# Altium schematic sheet DRIVERS.SchDoc
size 420 x 297 mm; PageSetup: Record=PageOptions|CenterHorizontal=False|CenterVertical=False|PrintScale=0.95|XCorrection=0.00|YCorrection=0.00|PrintKind=1|BorderSize=5000000|LeftOffset=0|BottomOffset=0|Orientation=1|PaperLength=1000|PaperWidth=1000|Scale=100|PaperSource=15|PrintQuality=600|MediaType=1|DitherType=10|PaperKind=A4|PrintScaleMode=1
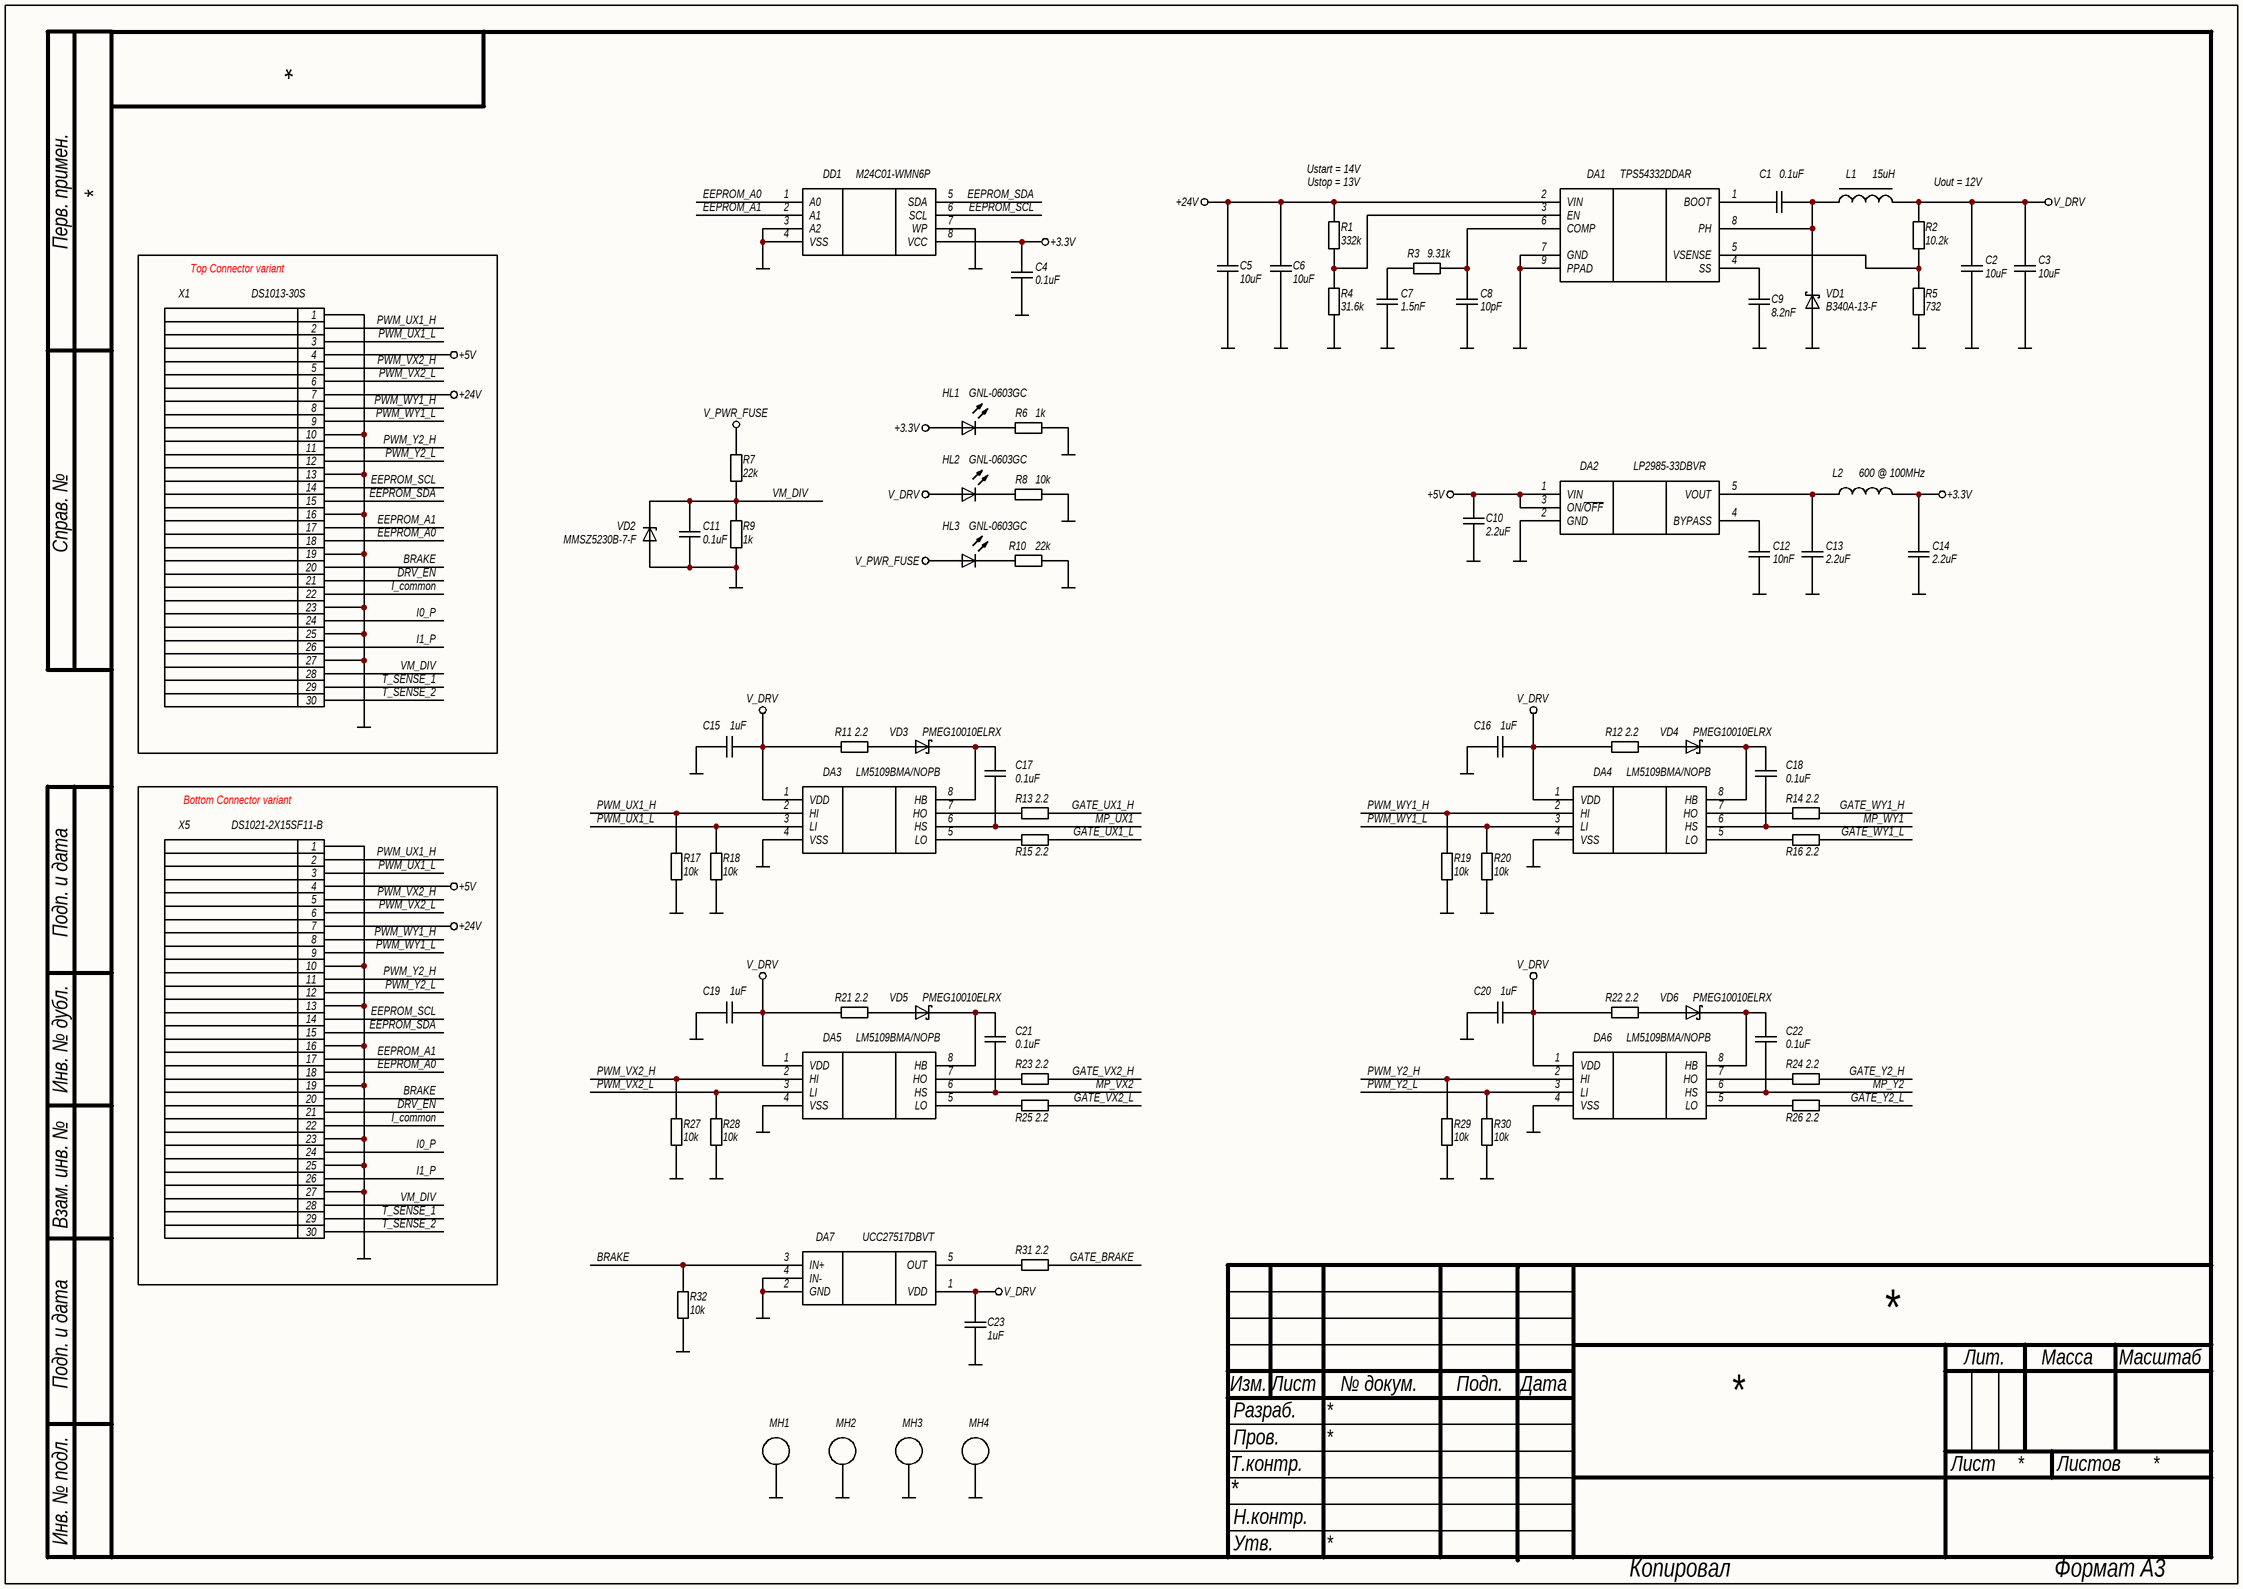
[diagram p0: DRIVERS.SchDoc]

## Parts
C1  0.1uF  [C0603N]
C2  10uF  [C0805N]
C3  10uF  [C0805N]
C4  0.1uF  [C0603N]
C5  10uF  [C1206N]
C6  10uF  [C1206N]
C7  1.5nF  [C0603N]
C8  10pF  [C0603N]
C9  8.2nF  [C0603N]
C10  2.2uF  [C0603N]
C11  0.1uF  [C0603N]
C12  10nF  [C0603N]
C13  2.2uF  [C0603N]
C14  2.2uF  [C0603N]
C15  1uF  [C0805N]
C16  1uF  [C0805N]
C17  0.1uF  [C0603N]
C18  0.1uF  [C0603N]
C19  1uF  [C0805N]
C20  1uF  [C0805N]
C21  0.1uF  [C0603N]
C22  0.1uF  [C0603N]
C23  1uF  [C0805N]
DA1  TPS54332DDAR  [SOIC8-EP]
DA2  LP2985-33DBVR  [DBV0005A (SOT23-5)]
DA3  LM5109BMA/NOPB  [D0008A]
DA4  LM5109BMA/NOPB  [D0008A]
DA5  LM5109BMA/NOPB  [D0008A]
DA6  LM5109BMA/NOPB  [D0008A]
DA7  UCC27517DBVT  [DBV0005A (SOT23-5)]
DD1  M24C01-WMN6P  [SOIC8]
HL1  GNL-0603GC  [LED0603]
HL2  GNL-0603GC  [LED0603]
HL3  GNL-0603GC  [LED0603]
L1  15uH  [SRN8040]
L2  600 @ 100MHz  [FB0603N]
MH1  MNT_HOLE_PL  [MH_3.2_5.4_PLATED_VIA]  (value not drawn)  (no BOM)
MH2  MNT_HOLE_PL  [MH_3.2_5.4_PLATED_VIA]  (value not drawn)  (no BOM)
MH3  MNT_HOLE_PL  [MH_3.2_5.4_PLATED_VIA]  (value not drawn)  (no BOM)
MH4  MNT_HOLE_PL  [MH_3.2_5.4_PLATED_VIA]  (value not drawn)  (no BOM)
R1  332k  [R0603N]
R2  10.2k  [R0603N]
R3  9.31k  [R0603N]
R4  31.6k  [R0603N]
R5  732  [R0603N]
R6  1k  [R0603N]
R7  22k  [R0603N]
R8  10k  [R0603N]
R9  1k  [R0603N]
R10  22k  [R0603N]
R11  2.2  [R0603N]
R12  2.2  [R0603N]
R13  2.2  [R0603N]
R14  2.2  [R0603N]
R15  2.2  [R0603N]
R16  2.2  [R0603N]
R17  10k  [R0603N]
R18  10k  [R0603N]
R19  10k  [R0603N]
R20  10k  [R0603N]
R21  2.2  [R0603N]
R22  2.2  [R0603N]
R23  2.2  [R0603N]
R24  2.2  [R0603N]
R25  2.2  [R0603N]
R26  2.2  [R0603N]
R27  10k  [R0603N]
R28  10k  [R0603N]
R29  10k  [R0603N]
R30  10k  [R0603N]
R31  2.2  [R0603N]
R32  10k  [R0603N]
VD1  B340A-13-F  [SMA]
VD2  MMSZ5230B-7-F  [SOD123]
VD3  PMEG10010ELRX  [SOD123W]
VD4  PMEG10010ELRX  [SOD123W]
VD5  PMEG10010ELRX  [SOD123W]
VD6  PMEG10010ELRX  [SOD123W]
X1  DS1013-30S  [2.54_2X15_HEADER_BOX]
X5  DS1021-2X15SF11-B  [2.54_2X15_HEADER]

## Blocks framed on the sheet
Top Connector variant: X1
Bottom Connector variant: X5

## Nets
+3.3V: C4.2 C14.2 DD1.8(VCC) HL1.2(A) L2.2
+5V: C10.2 DA2.1(VIN) DA2.3(ON/~{OFF}) X1.4 X5.4
+24V: C5.2 C6.2 DA1.2(VIN) R1.1 X1.7 X5.7
GND: C2.2 C3.1 C4.1 C5.1 C6.1 C7.1 C8.1 C9.1 C10.1 C11.1 C12.1 C13.1 C14.1 C15.2 C16.2 C19.2 C20.2 C23.2 DA1.7(GND) DA1.9(PPAD) DA2.2(GND) DA3.4(VSS) DA4.4(VSS) DA5.4(VSS) DA6.4(VSS) DA7.2(GND) DA7.4(IN-) DD1.3(A2) DD1.4(VSS) DD1.7(WP) MH1.1 MH2.1 MH3.1 MH4.1 R4.2 R5.2 R6.2 R8.2 R9.2 R10.2 R17.2 R18.2 R19.2 R20.2 R27.2 R28.2 R29.2 R30.2 R32.2 VD1.2(A) VD2.2(A) X1.1 X1.10 X1.13 X1.16 X1.19 X1.23 X1.25 X1.27 X5.1 X5.10 X5.13 X5.16 X5.19 X5.23 X5.25 X5.27
V_DRV: C2.1 C3.2 C15.1 C16.1 C19.1 C20.1 C23.1 DA3.1(VDD) DA4.1(VDD) DA5.1(VDD) DA6.1(VDD) DA7.1(VDD) HL2.2(A) L1.2 R2.1 R11.2 R12.2 R21.2 R22.2
V_PWR_FUSE: HL3.2(A) R7.1
BRAKE: DA7.3(IN+) R32.1 X1.20 X5.20
DRV_EN: X1.21 X5.21
EEPROM_A0: DD1.1(A0) X1.18 X5.18
EEPROM_A1: DD1.2(A1) X1.17 X5.17
EEPROM_SCL: DD1.6(SCL) X1.14 X5.14
EEPROM_SDA: DD1.5(SDA) X1.15 X5.15
GATE_BRAKE: R31.1
GATE_UX1_H: R13.1
GATE_UX1_L: R15.1
GATE_VX2_H: R23.1
GATE_VX2_L: R25.1
GATE_WY1_H: R14.1
GATE_WY1_L: R16.1
GATE_Y2_H: R24.1
GATE_Y2_L: R26.1
I0_P: X1.24 X5.24
I1_P: X1.26 X5.26
I_common: X1.22 X5.22
MP_UX1: C17.2 DA3.6(HS)
MP_VX2: C21.2 DA5.6(HS)
MP_WY1: C18.2 DA4.6(HS)
MP_Y2: C22.2 DA6.6(HS)
PWM_UX1_H: DA3.2(HI) R17.1 X1.2 X5.2
PWM_UX1_L: DA3.3(LI) R18.1 X1.3 X5.3
PWM_VX2_H: DA5.2(HI) R27.1 X1.5 X5.5
PWM_VX2_L: DA5.3(LI) R28.1 X1.6 X5.6
PWM_WY1_H: DA4.2(HI) R19.1 X1.8 X5.8
PWM_WY1_L: DA4.3(LI) R20.1 X1.9 X5.9
PWM_Y2_H: DA6.2(HI) R29.1 X1.11 X5.11
PWM_Y2_L: DA6.3(LI) R30.1 X1.12 X5.12
T_SENSE_1: X1.29 X5.29
T_SENSE_2: X1.30 X5.30
VM_DIV: C11.2 R7.2 R9.1 VD2.1(K) X1.28 X5.28
NetC1_1: C1.1 DA1.1(BOOT)
NetC1_2: C1.2 DA1.8(PH) L1.1 VD1.1(K)
NetC7_2: C7.2 R3.2
NetC8_2: C8.2 DA1.6(COMP) R3.1
NetC9_2: C9.2 DA1.4(SS)
NetC12_2: C12.2 DA2.4(BYPASS)
NetC13_2: C13.2 DA2.5(VOUT) L2.1
NetC17_1: C17.1 DA3.8(HB) VD3.1(K)
NetC18_1: C18.1 DA4.8(HB) VD4.1(K)
NetC21_1: C21.1 DA5.8(HB) VD5.1(K)
NetC22_1: C22.1 DA6.8(HB) VD6.1(K)
NetDA1_3: DA1.3(EN) R1.2 R4.1
NetDA1_5: DA1.5(VSENSE) R2.2 R5.1
NetDA3_5: DA3.5(LO) R15.2
NetDA3_7: DA3.7(HO) R13.2
NetDA4_5: DA4.5(LO) R16.2
NetDA4_7: DA4.7(HO) R14.2
NetDA5_5: DA5.5(LO) R25.2
NetDA5_7: DA5.7(HO) R23.2
NetDA6_5: DA6.5(LO) R26.2
NetDA6_7: DA6.7(HO) R24.2
NetDA7_5: DA7.5(OUT) R31.2
NetHL1_1: HL1.1(K) R6.1
NetHL2_1: HL2.1(K) R8.1
NetHL3_1: HL3.1(K) R10.1
NetR11_1: R11.1 VD3.2(A)
NetR12_1: R12.1 VD4.2(A)
NetR21_1: R21.1 VD5.2(A)
NetR22_1: R22.1 VD6.2(A)

## Notes on the sheet
- (near R1) Ustart = 14V
- (near R1) Ustop = 13V
- Uout = 12V
- Перв. примен.
- Справ. №
- Подп. и дата
- Инв. № дубл.
- Взам. инв. №
- Изм.
- Лист
- № докум.
- Подп.
- Дата
- Лит.
- Масса
- Масштаб
- Т.контр.
- Пров.
- Разраб.
- Листов
- Инв. № подл.
- Н.контр.
- Утв.
- Копировал
- Формат А3

## Library data of the parts
C1 C4 C11 C17 C18 C21 C22 = CL10B104KB8NNNC: Конденсатор; Точность: 10%; Напряжение: 50V; Диэлектрик: X7R; Производитель: Samsung Electro-Mechanics; Описание: 0.1 µF ±10% 50V Ceramic Capacitor X7R 0603 (1608 Metric); Корпус: 0603 (1608 Metric); Температурный диапазон: -55°C ~ 125°C; Вид монтажа: SMD; Артикул: CL10B104KB8NNNC; Номинал: 0.1uF; Строка для документации: https://mm.digikey.com/Volume0/opasdata/d220001/medias/docus/609/CL10B104KB8NNNC_Spec.pdf; Тип элемента: Конденсатор
C2 C3 = CL21A106KAYNNNE: Конденсатор; Точность: 10%; Напряжение: 25V; Диэлектрик: X5R; Производитель: Samsung Electro-Mechanics; Описание: 10 µF ±10% 25V Ceramic Capacitor X5R 0805 (2012 Metric); Корпус: 0805 (2012 Metric); Температурный диапазон: -55°C ~ 85°C; Вид монтажа: SMD; Артикул: CL21A106KAYNNNE; Номинал: 10uF; Строка для документации: https://mm.digikey.com/Volume0/opasdata/d220001/medias/docus/5545/CL21A106KAYNNNE%20Spec.pdf; Тип элемента: Конденсатор
C5 C6 = CL31B106KBHNNNE: Конденсатор; Точность: 10%; Напряжение: 50V; Диэлектрик: X7R; Производитель: Samsung Electro-Mechanics; Описание: 10 µF ±10% 50V Ceramic Capacitor X7R 1206 (3216 Metric); Корпус: 1206 (3216 Metric); Температурный диапазон: -55°C ~ 125°C; Вид монтажа: SMD; Артикул: CL31B106KBHNNNE; Номинал: 10uF; Строка для документации: https://mm.digikey.com/Volume0/opasdata/d220001/medias/docus/41/CL31B106KBHNNNE_Spec.pdf; Тип элемента: Конденсатор
C7 = CL10B152KB8WPNC: Конденсатор; Точность: 10%; Напряжение: 50V; Диэлектрик: X7R; Производитель: Samsung Electro-Mechanics; Описание: 1500 pF ±10% 50V Ceramic Capacitor X7R 0603 (1608 Metric); Корпус: 0603 (1608 Metric); Температурный диапазон: -55°C ~ 125°C; Вид монтажа: SMD; Артикул: CL10B152KB8WPNC; Номинал: 1.5nF; Строка для документации: https://mm.digikey.com/Volume0/opasdata/d220001/medias/docus/41/CL10B152KB8WPNC_Spec.pdf; Тип элемента: Конденсатор
C8 = CL10C100CB8NNNC: Конденсатор; Точность: ±0.25pF; Напряжение: 50V; Диэлектрик: NP0; Производитель: Samsung Electro-Mechanics; Описание: 10 pF ±0.25pF 50V Ceramic Capacitor C0G, NP0 0603 (1608 Metric); Корпус: 0603 (1608 Metric); Температурный диапазон: -55°C ~ 125°C; Вид монтажа: SMD; Артикул: CL10C100CB8NNNC; Номинал: 10pF; Строка для документации: https://www.samsungsem.com/resources/file/global/support/product_catalog/MLCC.pdf; Тип элемента: Конденсатор
C9 = CC0603KRX7R9BB822: Конденсатор; Точность: 10%; Напряжение: 50V; Диэлектрик: X7R; Производитель: YAGEO; Описание: 8200 pF ±10% 50V Ceramic Capacitor X7R 0603 (1608 Metric); Корпус: 0603 (1608 Metric); Температурный диапазон: -55°C ~ 125°C; Вид монтажа: SMD; Артикул: CC0603KRX7R9BB822; Номинал: 8.2nF; Строка для документации: https://www.yageo.com/upload/media/product/productsearch/datasheet/mlcc/UPY-GPHC_X7R_6.3V-to-250V_23.pdf; Тип элемента: Конденсатор
C10 C13 C14 = CL10A225KO8NNNC: Конденсатор; Точность: 10%; Напряжение: 16V; Диэлектрик: X5R; Производитель: Samsung Electro-Mechanics; Описание: 2.2 µF ±10% 16V Ceramic Capacitor X5R 0603 (1608 Metric); Корпус: 0603 (1608 Metric); Температурный диапазон: -55°C ~ 85°C; Вид монтажа: SMD; Артикул: CL10A225KO8NNNC; Номинал: 2.2uF; Строка для документации: https://mm.digikey.com/Volume0/opasdata/d220001/medias/docus/421/CL10A225KO8NNNC_Spec.pdf; Тип элемента: Конденсатор
C12 = CL10B103KB8NNNC: Конденсатор; Точность: 10%; Напряжение: 16V; Диэлектрик: X7R; Производитель: Samsung Electro-Mechanics; Описание: 10000 pF ±10% 50V Ceramic Capacitor X7R 0603 (1608 Metric); Корпус: 0603 (1608 Metric); Температурный диапазон: -55°C ~ 125°C; Вид монтажа: SMD; Артикул: CL10B103KB8NNNC; Номинал: 10nF; Строка для документации: https://mm.digikey.com/Volume0/opasdata/d220001/medias/docus/609/CL10B103KB8NNNC_Spec.pdf; Тип элемента: Конденсатор
C15 C16 C19 C20 C23 = CL21B105KAFNNNE: Конденсатор; Точность: 10%; Напряжение: 25V; Диэлектрик: X7R; Производитель: Samsung Electro-Mechanics; Описание: 1 µF ±10% 25V Ceramic Capacitor X7R 0805 (2012 Metric); Корпус: 0805 (2012 Metric); Вид монтажа: SMD; Артикул: CL21B105KAFNNNE; Номинал: 1uF; Строка для документации: https://mm.digikey.com/Volume0/opasdata/d220001/medias/docus/1105/CL21B105KAFNNNE_Spec.pdf; Тип элемента: Конденсатор
DA1 = TPS54332DDAR: Микросхема понижающего преобразователя; Производитель: Texas Instruments; Описание: Buck Switching Regulator IC Positive Adjustable 0.8V 1 Output 3.5A 8-PowerSOIC (0.154", 3.90mm Width); Корпус: 8-PowerSOIC (0.154", 3.90mm Width); Температурный диапазон: -40°C ~ 150°C (TJ); Вид монтажа: SMD; Артикул: TPS54332DDAR; Строка для документации: https://www.ti.com/lit/ds/symlink/tps54332.pdf; Тип элемента: Микросхема
DA2 = LP2985-33DBVR: Микросхема стабилизатор напряжения положительной полярности; Производитель: Texas Instruments; Описание: Linear Voltage Regulator IC Positive Fixed 1 Output 150mA SOT-23-5; Корпус: SOT-23-5; Температурный диапазон: -40°C ~ 125°C; Вид монтажа: SMD; Артикул: LP2985-33DBVR; Строка для документации: https://www.ti.com/lit/ds/symlink/lp2985.pdf; Тип элемента: Микросхема
DA3-DA6 = LM5109BMA/NOPB: Микросхема драйвер затворов нижнего и верхнего ключа; Производитель: Texas Instruments; Описание: Half-Bridge Gate Driver IC Non-Inverting 8-SOIC; Корпус: 8-SOIC (0.154", 3.90mm Width); Температурный диапазон: -40°C ~ 125°C (TJ); Вид монтажа: SMD; Артикул: LM5109BMA/NOPB; Строка для документации: https://www.ti.com/lit/ds/symlink/lm5109b.pdf; Тип элемента: Микросхема
DA7 = UCC27517DBVT: Микросхема драйвер затвора нижнего ключа; Производитель: Texas Instruments; Описание: Low-Side Gate Driver IC Inverting, Non-Inverting SOT-23-5; Корпус: SOT-23-5; Температурный диапазон: -40°C ~ 140°C (TJ); Вид монтажа: SMD; Артикул: UCC27517DBVT; Строка для документации: https://www.ti.com/lit/ds/symlink/ucc27517.pdf; Тип элемента: Микросхема
DD1 = M24C01-WMN6P: Микросхема EEPROM с I2C интерфейсом; Производитель: STMicroelectronics; Описание: EEPROM Memory IC 1Kbit I2C 400 kHz 900 ns 8-SOIC; Корпус: 8-SOIC (0.154", 3.90mm Width); Температурный диапазон: -40°C ~ 85°C (TA); Вид монтажа: SMD; Артикул: M24C01-WMN6P; Строка для документации: https://www.st.com/content/ccc/resource/technical/document/datasheet/b0/d8/50/40/5a/85/49/6f/DM00071904.pdf/files/DM00071904.pdf/jcr:content/translations/en.DM00071904.pdf; Тип элемента: Микросхема
HL1-HL3 = GNL-0603GC: Светодиод; Прямой ток: 20mA; Напряжение: 2V; Цвет: Зеленый; Длина волны: 567nm; Производитель: G-nor Electronics; Описание: Green 567nm LED Indication - Discrete 2V 0603 (1608 Metric); Корпус: 0603 (1608 Metric); Температурный диапазон: -40°C ~ 80°C; Вид монтажа: SMD; Тип элемента: Диод; Артикул: GNL-0603GC; Яркость: LED; Строка для документации: https://www.g-nor.com/Uploads/Ed/file/20210517/1621223120713818.doc
L1 = SRN8040-150M: Дроссель с магнитопроводом; Точность: 20%; Ток номинальный: 2.4A; Ток насыщения: 2.7A; Сопротивление: 70m; Производитель: Bourns Inc.; Описание: 15 µH Semi-Shielded Drum Core, Wirewound Inductor 2.4 A 70mOhm Max Nonstandard; Корпус: 8.00mm x 8.00mm; Температурный диапазон: -40°C ~ 125°C; Вид монтажа: SMD; Артикул: SRN8040-150M; Номинал: 15uH; Строка для документации: https://www.bourns.com/docs/Product-Datasheets/SRN8040.pdf; Тип элемента: Дроссель
L2 = BLM18AG601SN1D: Фильтр ЭМП индуктивный; Ток: 500mA; Сопротивление: 380m; Тип: Ferrite Bead; Производитель: Murata Electronics; Описание: 600 Ohms @ 100 MHz 1 Ferrite Bead 0603 (1608 Metric) 500mA 380mOhm; Корпус: 0603 (1608 Metric); Температурный диапазон: -55°C ~ 125°C; Вид монтажа: SMD; Артикул: BLM18AG601SN1D; Номинал: 600 @ 100MHz; Строка для документации: https://www.murata.com/en-us/products/productdata/8796738650142/ENFA0003.pdf; Тип элемента: Фильтр ЭМП
MH1-MH4 = Mounting Hole, 3.2mm/5.4mm, plated, with via stiching: Монтажное отверстие, металлизированное; Тип элемента: Механический; Артикул: Mounting Hole, 3.2mm/5.4mm, plated, with via stiching; Описание: Mounting Hole, 3.2mm/5.4mm , plated, with via stiching; Тип: Mounting Hole
R1 = RC0603FR-07332KL: Резистор; Точность: 1%; ТКС: ±100ppm/°C; Напряжение: 75V; Производитель: YAGEO; Описание: 332 kOhms ±1% 0.1W, 1/10W Chip Resistor 0603 (1608 Metric) Moisture Resistant Thick Film; Корпус: 0603 (1608 Metric); Температурный диапазон: -55°C ~ 155°C; Вид монтажа: SMD; Артикул: RC0603FR-07332KL; Номинал: 332k; Строка для документации: https://www.yageo.com/upload/media/product/app/datasheet/rchip/pyu-rc_group_51_rohs_l.pdf; Тип элемента: Резистор
R2 = RC0603FR-0710K2L: Резистор; Точность: 1%; ТКС: ±100ppm/°C; Напряжение: 75V; Производитель: YAGEO; Описание: 10.2 kOhms ±1% 0.1W, 1/10W Chip Resistor 0603 (1608 Metric) Moisture Resistant Thick Film; Корпус: 0603 (1608 Metric); Температурный диапазон: -55°C ~ 155°C; Вид монтажа: SMD; Артикул: RC0603FR-0710K2L; Номинал: 10.2k; Строка для документации: https://www.yageo.com/upload/media/product/app/datasheet/rchip/pyu-rc_group_51_rohs_l.pdf; Тип элемента: Резистор
R3 = RC0603FR-079K31L: Резистор; Точность: 1%; ТКС: ±100ppm/°C; Напряжение: 75V; Производитель: YAGEO; Описание: 9.31 kOhms ±1% 0.1W, 1/10W Chip Resistor 0603 (1608 Metric) Moisture Resistant Thick Film; Корпус: 0603 (1608 Metric); Температурный диапазон: -55°C ~ 155°C; Вид монтажа: SMD; Артикул: RC0603FR-079K31L; Номинал: 9.31k; Строка для документации: https://www.yageo.com/upload/media/product/app/datasheet/rchip/pyu-rc_group_51_rohs_l.pdf; Тип элемента: Резистор
R4 = RC0603FR-0731K6L: Резистор; Точность: 1%; ТКС: ±100ppm/°C; Напряжение: 75V; Производитель: YAGEO; Описание: 31.6 kOhms ±1% 0.1W, 1/10W Chip Resistor 0603 (1608 Metric) Moisture Resistant Thick Film; Корпус: 0603 (1608 Metric); Температурный диапазон: -55°C ~ 155°C; Вид монтажа: SMD; Артикул: RC0603FR-0731K6L; Номинал: 31.6k; Строка для документации: https://www.yageo.com/upload/media/product/app/datasheet/rchip/pyu-rc_group_51_rohs_l.pdf; Тип элемента: Резистор
R5 = RC0603FR-07732RL: Резистор; Точность: 1%; ТКС: ±100ppm/°C; Напряжение: 75V; Производитель: YAGEO; Описание: 732 kOhms ±1% 0.1W, 1/10W Chip Resistor 0603 (1608 Metric) Moisture Resistant Thick Film; Корпус: 0603 (1608 Metric); Температурный диапазон: -55°C ~ 155°C; Вид монтажа: SMD; Артикул: RC0603FR-07732RL; Номинал: 732; Строка для документации: https://www.yageo.com/upload/media/product/app/datasheet/rchip/pyu-rc_group_51_rohs_l.pdf; Тип элемента: Резистор
R6 R9 = RC0603FR-071KL: Резистор; Точность: 1%; ТКС: ±100ppm/°C; Напряжение: 75V; Производитель: YAGEO; Описание: 1 kOhms ±1% 0.1W, 1/10W Chip Resistor 0603 (1608 Metric) Moisture Resistant Thick Film; Корпус: 0603 (1608 Metric); Температурный диапазон: -55°C ~ 155°C; Вид монтажа: SMD; Артикул: RC0603FR-071KL; Номинал: 1k; Строка для документации: https://www.yageo.com/upload/media/product/app/datasheet/rchip/pyu-rc_group_51_rohs_l.pdf; Тип элемента: Резистор
R7 R10 = RC0603FR-0722KL: Резистор; Точность: 1%; ТКС: ±100ppm/°C; Напряжение: 75V; Производитель: YAGEO; Описание: 22 kOhms ±1% 0.1W, 1/10W Chip Resistor 0603 (1608 Metric) Moisture Resistant Thick Film; Корпус: 0603 (1608 Metric); Температурный диапазон: -55°C ~ 155°C; Вид монтажа: SMD; Артикул: RC0603FR-0722KL; Номинал: 22k; Строка для документации: https://www.yageo.com/upload/media/product/app/datasheet/rchip/pyu-rc_group_51_rohs_l.pdf; Тип элемента: Резистор
R8 R17-R20 R27-R30 R32 = RC0603FR-0710KL: Резистор; Точность: 1%; ТКС: ±100ppm/°C; Напряжение: 75V; Производитель: YAGEO; Описание: 10 kOhms ±1% 0.1W, 1/10W Chip Resistor 0603 (1608 Metric) Moisture Resistant Thick Film; Корпус: 0603 (1608 Metric); Температурный диапазон: -55°C ~ 155°C; Вид монтажа: SMD; Артикул: RC0603FR-0710KL; Номинал: 10k; Строка для документации: https://www.yageo.com/upload/media/product/app/datasheet/rchip/pyu-rc_group_51_rohs_l.pdf; Тип элемента: Резистор
R11-R16 R21-R26 R31 = RC0603FR-072R2L: Резистор; Точность: 1%; ТКС: ±100ppm/°C; Напряжение: 75V; Производитель: YAGEO; Описание: 2.2 Ohms ±1% 0.1W, 1/10W Chip Resistor 0603 (1608 Metric) Moisture Resistant Thick Film; Корпус: 0603 (1608 Metric); Температурный диапазон: -55°C ~ 155°C; Вид монтажа: SMD; Артикул: RC0603FR-072R2L; Номинал: 2.2; Строка для документации: https://www.yageo.com/upload/media/product/app/datasheet/rchip/pyu-rc_group_51_rohs_l.pdf; Тип элемента: Резистор
VD1 = B340A-13-F: Диод Шоттки; Прямой ток: 3A; Напряжение: 40V; Производитель: Diodes Incorporated; Описание: Diode 40 V 3A Surface Mount SMA; Корпус: DO-214AC, SMA; Температурный диапазон: -55°C ~ 150°C; Вид монтажа: SMD; Артикул: B340A-13-F; Тип: Schottky; Строка для документации: https://www.diodes.com/assets/Datasheets/ds30891.pdf; Тип элемента: Диод
VD2 = MMSZ5230B-7-F: Стабилитрон; Прямой ток: 20mA; Напряжение: 4.7V; Производитель: Diodes Incorporated; Описание: Zener Diode 4.7 V 500 mW ±5% Surface Mount SOD-123; Корпус: SOD-123; Температурный диапазон: -65°C ~ 150°C; Вид монтажа: SMD; Тип элемента: Диод; Артикул: MMSZ5230B-7-F; Тип: Zener; Строка для документации: https://www.diodes.com/assets/Datasheets/ds18010.pdf
VD3-VD6 = PMEG10010ELRX: Диод Шоттки; Прямой ток: 1A; Напряжение: 100V; Производитель: Nexperia USA Inc.; Описание: Diode 100 V 1A Surface Mount SOD-123W; Корпус: SOD-123W; Температурный диапазон: -40°C ~ 175°C; Вид монтажа: SMD; Артикул: PMEG10010ELRX; Тип: Schottky; Строка для документации: https://assets.nexperia.com/documents/data-sheet/PMEG10010ELR.pdf; Тип элемента: Диод
X1 = DS1013-30S: Разъем, 30 контактов; Тип разъема: Header, Male Pin; Количество контактов: 30; Шаг контактов: 2.54mm; Ток: 3A; Напряжение: 250V; Производитель: Connfly electronic (Zhenqin); Описание: Connector Header Through Hole 30 position 0.100" (2.54mm); Температурный диапазон: -40°C ~ 105°C; Вид монтажа: Through Hole; Артикул: DS1013-30S; Строка для документации: http://cn.connfly.group/static/upload/file/pdf/DS1013.pdf; Тип элемента: Разъем
X5 = DS1021-2X15SF11-B: Разъем, 30 контактов; Тип разъема: Header, Male Pin; Количество контактов: 30; Шаг контактов: 2.54mm; Ток: 3A; Напряжение: 250V; Производитель: Connfly electronic (Zhenqin); Описание: Connector Header Through Hole 30 position 0.100" (2.54mm); Температурный диапазон: -40°C ~ 105°C; Вид монтажа: Through Hole; Артикул: DS1021-2X15SF11-B; Строка для документации: http://cn.connfly.group/static/upload/file/pdf/DS1021.pdf; Тип элемента: Разъем